# EAGLE design T00R2 (EAGLE 9.6.1)
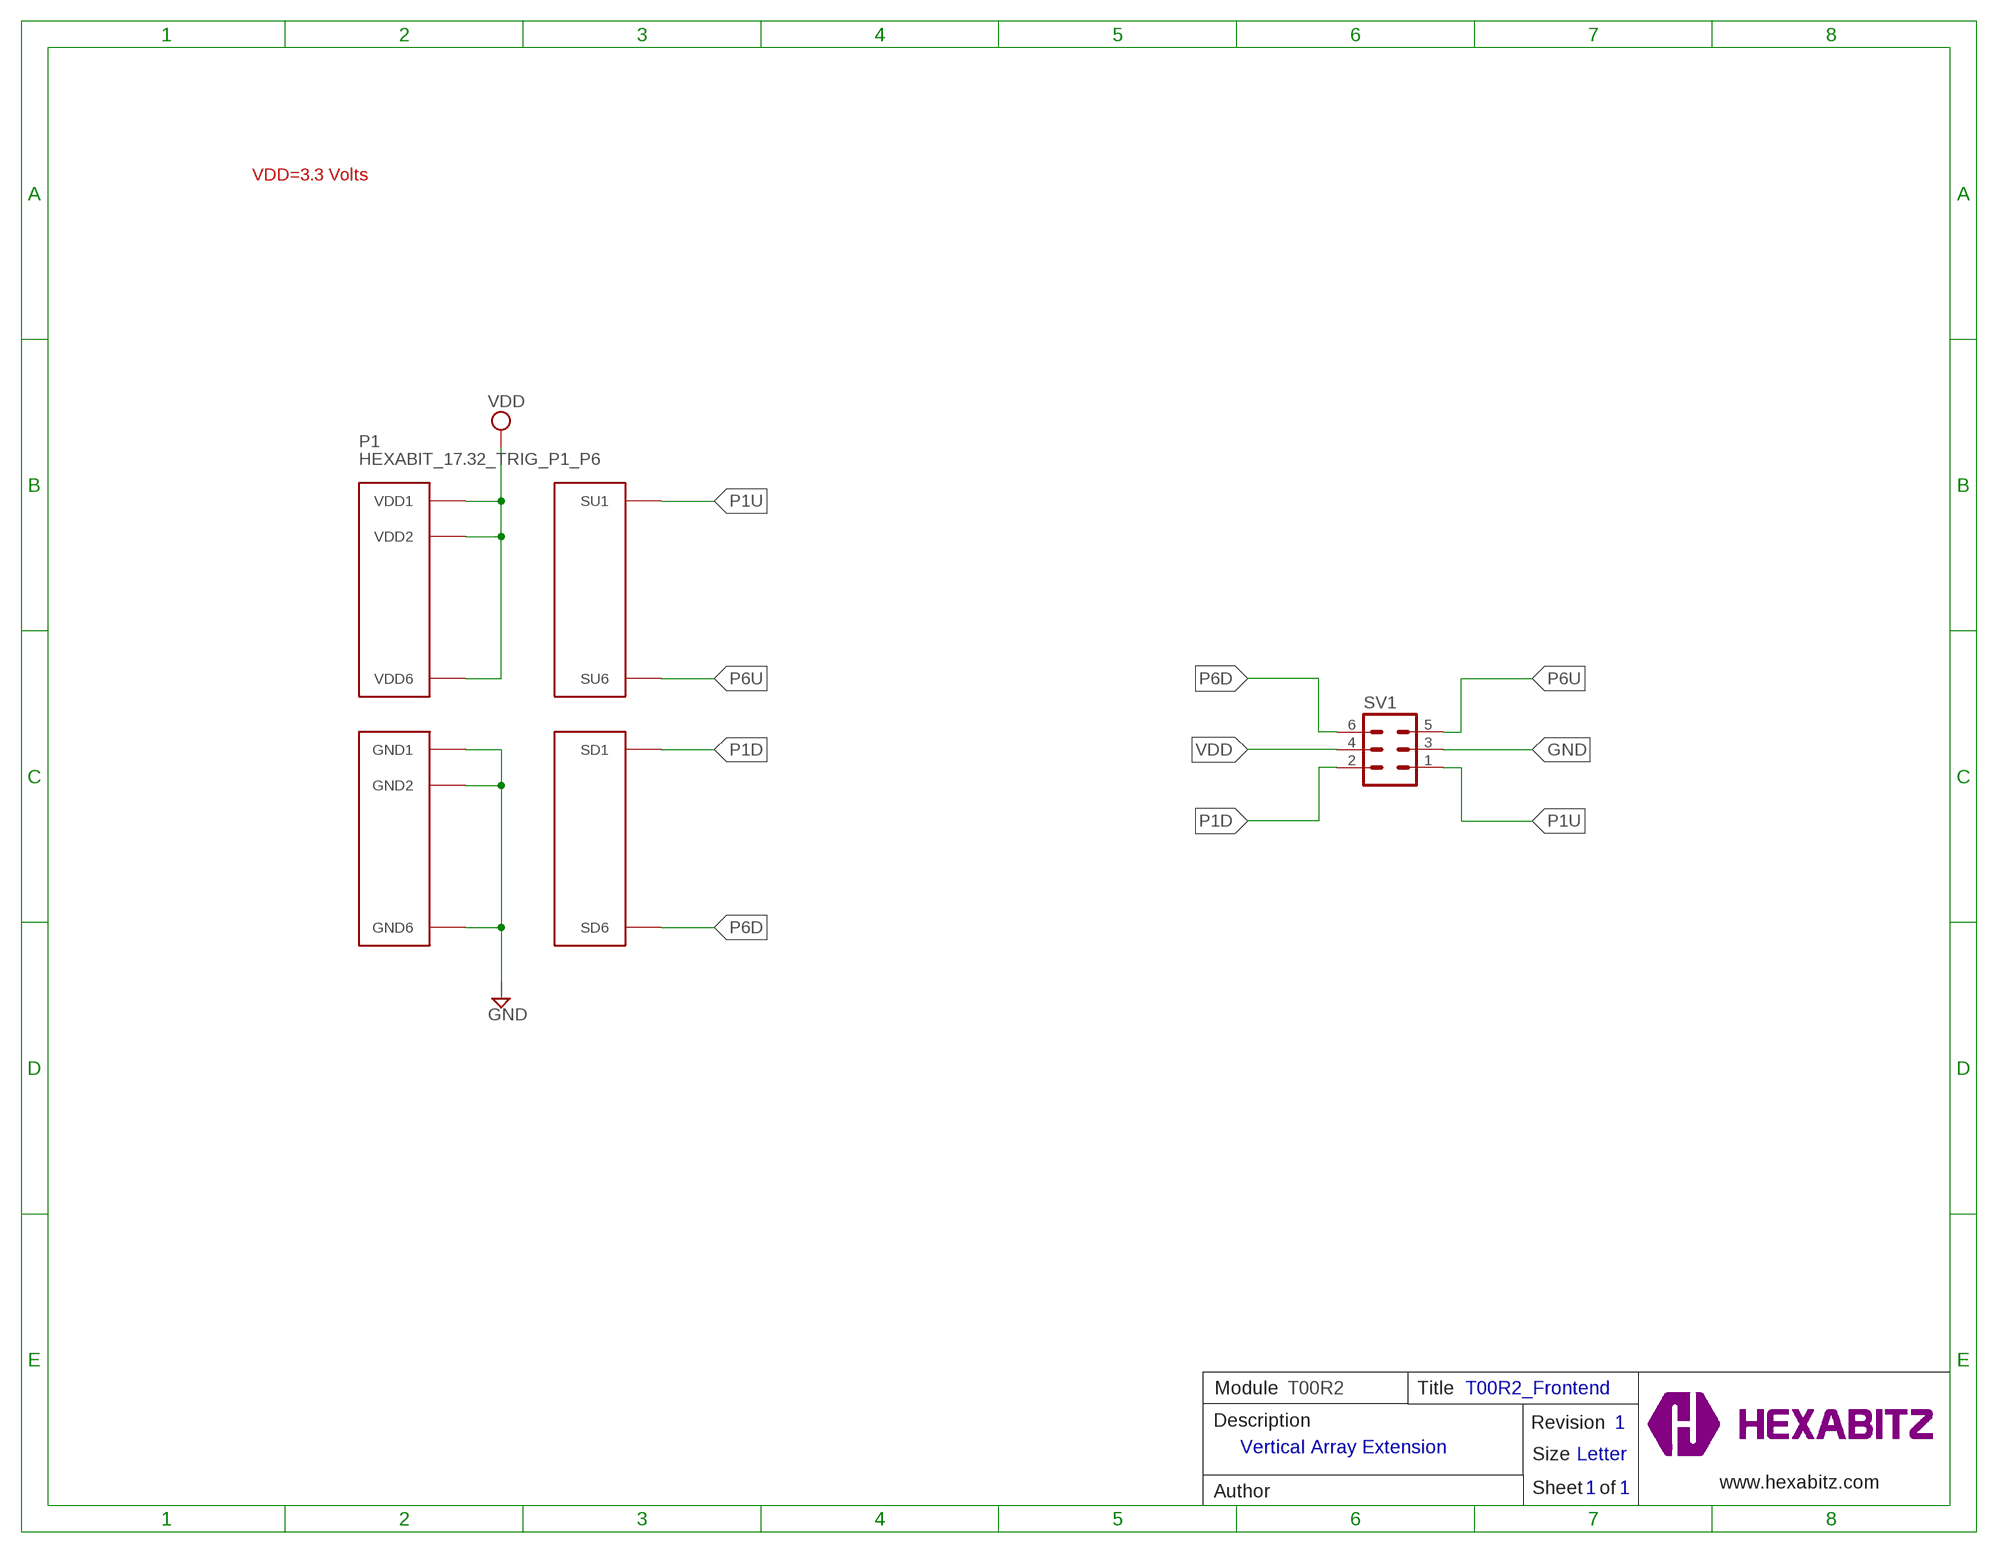
[diagram p0: schematic, sheet 1]

## Parts
P1  HEXABIT_17.32_TRIG_P1_P6  [HEXABIT_17.32_TRIG_P1_P6]
SV1  MA03-2  [MA03-2]

## Nets
GND: P1.PAD_PD7(GND1) P1.PAD_PD8(GND2) P1.PAD_PD12(GND6) SV1.3
P1D: P1.PAD_PD1(SD1) SV1.2
P1U: P1.PAD_PU1(SU1) SV1.1
P6D: P1.PAD_PD6(SD6) SV1.6
P6U: P1.PAD_PU6(SU6) SV1.5
VDD: P1.PAD_PU7(VDD1) P1.PAD_PU8(VDD2) P1.PAD_PU12(VDD6) SV1.4

## Notes on the sheet
- VDD=3.3 Volts
- Module | T00R2 | Title | T00R2_Frontend
- Description | Revision | 1
- Vertical Array Extension
- Size | Letter
- www.hexabitz.com
- Author | Sheet   of | 1 | 1

## Library data of the parts
P1 = hexabitz_connectors:HEXABIT_17.32_TRIG_P1_P6: Hexabitz Hexagon Module Connector Hexagon side length = 17.32mm.
SV1 = Hexabitz:MA03-2: PIN HEADER; OC_FARNELL: unknown; OC_NEWARK: unknown

## Board
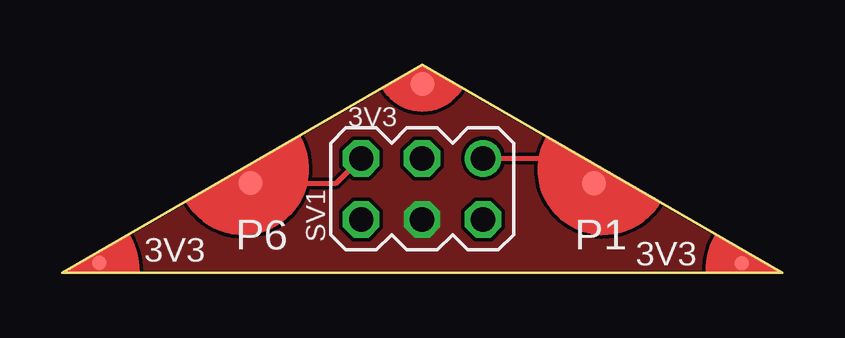
[diagram p1: board, top side]
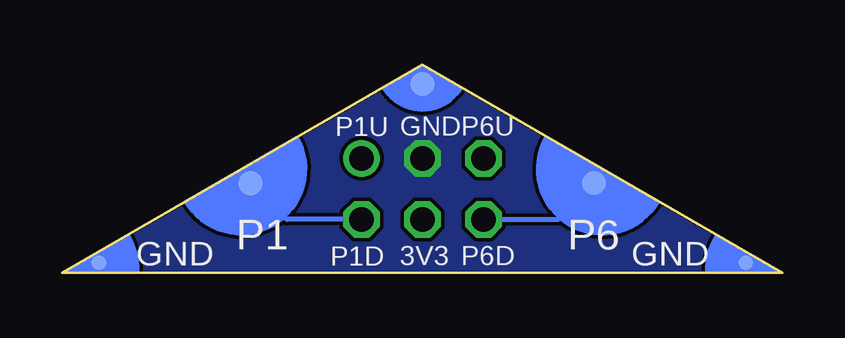
[diagram p2: board, bottom side, seen from below]

Size 30 x 8.66 mm. Coordinates in mm from the lower left corner, seen from the top.
Copper layers (1*16): Top 0.035mm / dielectric 1.5mm / Bottom 0.035mm
Design rules "2_layer *": minimum track width 7mil, minimum drill 10mil, track to track 6mil, track to pad 6mil, pad to pad 32mil, via to via 6mil, smd to smd 0mil, copper to edge 1mil, drill to drill 8mil, minimum pad ring 10mil, minimum via ring 8mil, stop-mask expansion 2mil, vias tented up to drill 15mil, thermal gap 10mil

### Footprints (pad centres in the part's own frame; a part is rotated, then mirrored left to right if it is on the bottom)
HEXABIT_17.32_TRIG_P1_P6 = smd 1 x 1 rotated 30 bottom: PAD_PD1 7.164,3.727; PAD_PD6 -7.146,3.733; PAD_PD7 0.008,7.863 | smd 0.61 x 0.61 rotated 30 bottom: PAD_PD8 13.484,0.417; PAD_PD12 -13.461,0.416 | smd 1 x 1 rotated 30: PAD_PU1 7.164,3.727; PAD_PU6 -7.146,3.733; PAD_PU7 0.008,7.863 | smd 0.61 x 0.61 rotated 30: PAD_PU8 13.316,0.401; PAD_PU12 -13.461,0.416
MA03-2 = drill 1.016: 1 -2.54,-1.27 | drill 1.016 octagon: 2 -2.54,1.27; 3 0,-1.27; 4 0,1.27; 5 2.54,-1.27; 6 2.54,1.27

### Placement (x,y rotation side)
P1  14.99,0 0 top
SV1  14.99,3.49 180 top

### Tracks (layer width: path | path; a pad name or v marks a point on that pad's centre or on a via)
GND
  pour Bottom (no thermals): -0.02,-0.01 29.97,-0.01 14.98,8.68
P1D
  Bottom 0.203: SV1.2 20.65,2.22 P1.PAD_PD1
P1U
  Top 0.203: SV1.1 21.12,4.76 P1.PAD_PU1
P6D
  Bottom 0.203: SV1.6 9.36,2.22 P1.PAD_PD6
P6U
  Top 0.203: P1.PAD_PU6 11.42,3.73 SV1.5
VDD
  pour Top (no thermals): -0.02,-0.01 29.97,-0.01 14.99,8.67

### Text on the board
tPlace: 3V3 | 3V3 | P6 | P1 | 3V3
bPlace: GND | P6 | P1 | GND
bNames: P1U | P6U | GND | P1D | P6D | 3V3